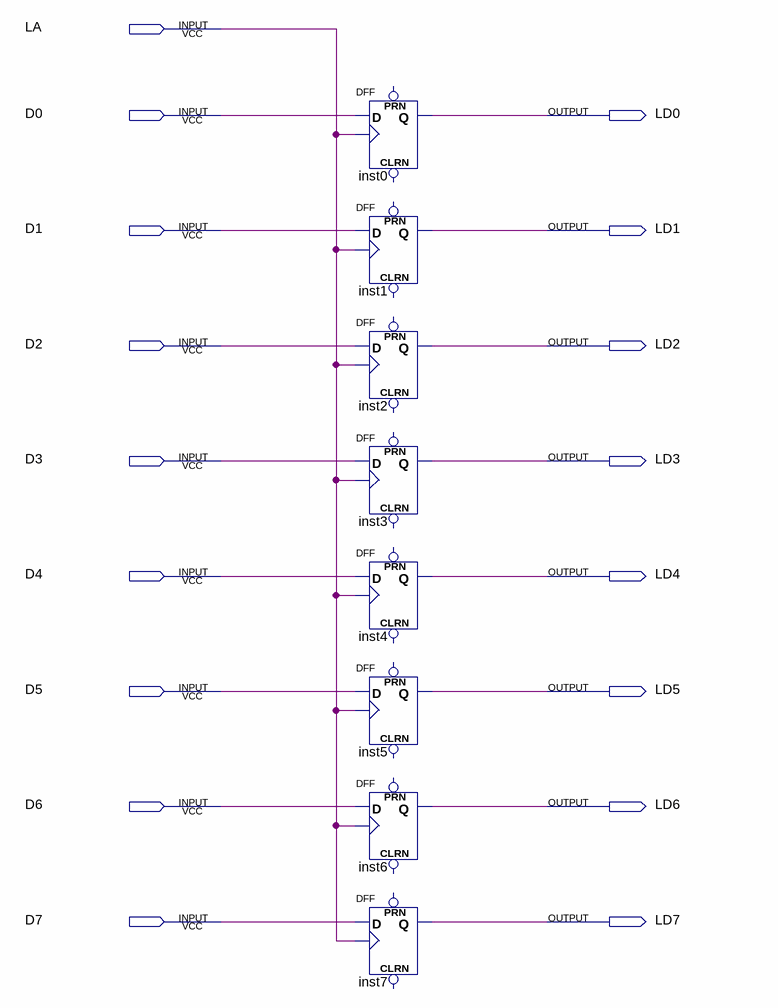
[diagram p0: schematic sheet]
// Quartus schematic 8latchedge_.bdf as structural Verilog: 8 symbols, 17 pins
module \8latchedge_  (
  input  LA,
  input  D0,
  input  D1,
  input  D2,
  input  D3,
  input  D4,
  input  D5,
  input  D6,
  input  D7,
  output LD0,
  output LD1,
  output LD2,
  output LD3,
  output LD4,
  output LD5,
  output LD6,
  output LD7
);

  DFF inst0 (.CLK(LA), .D(D0), .Q(LD0));  // open: CLRN, PRN
  DFF inst1 (.CLK(LA), .D(D1), .Q(LD1));  // open: CLRN, PRN
  DFF inst2 (.CLK(LA), .D(D2), .Q(LD2));  // open: CLRN, PRN
  DFF inst3 (.CLK(LA), .D(D3), .Q(LD3));  // open: CLRN, PRN
  DFF inst4 (.CLK(LA), .D(D4), .Q(LD4));  // open: CLRN, PRN
  DFF inst5 (.CLK(LA), .D(D5), .Q(LD5));  // open: CLRN, PRN
  DFF inst6 (.CLK(LA), .D(D6), .Q(LD6));  // open: CLRN, PRN
  DFF inst7 (.CLK(LA), .D(D7), .Q(LD7));  // open: CLRN, PRN
endmodule
